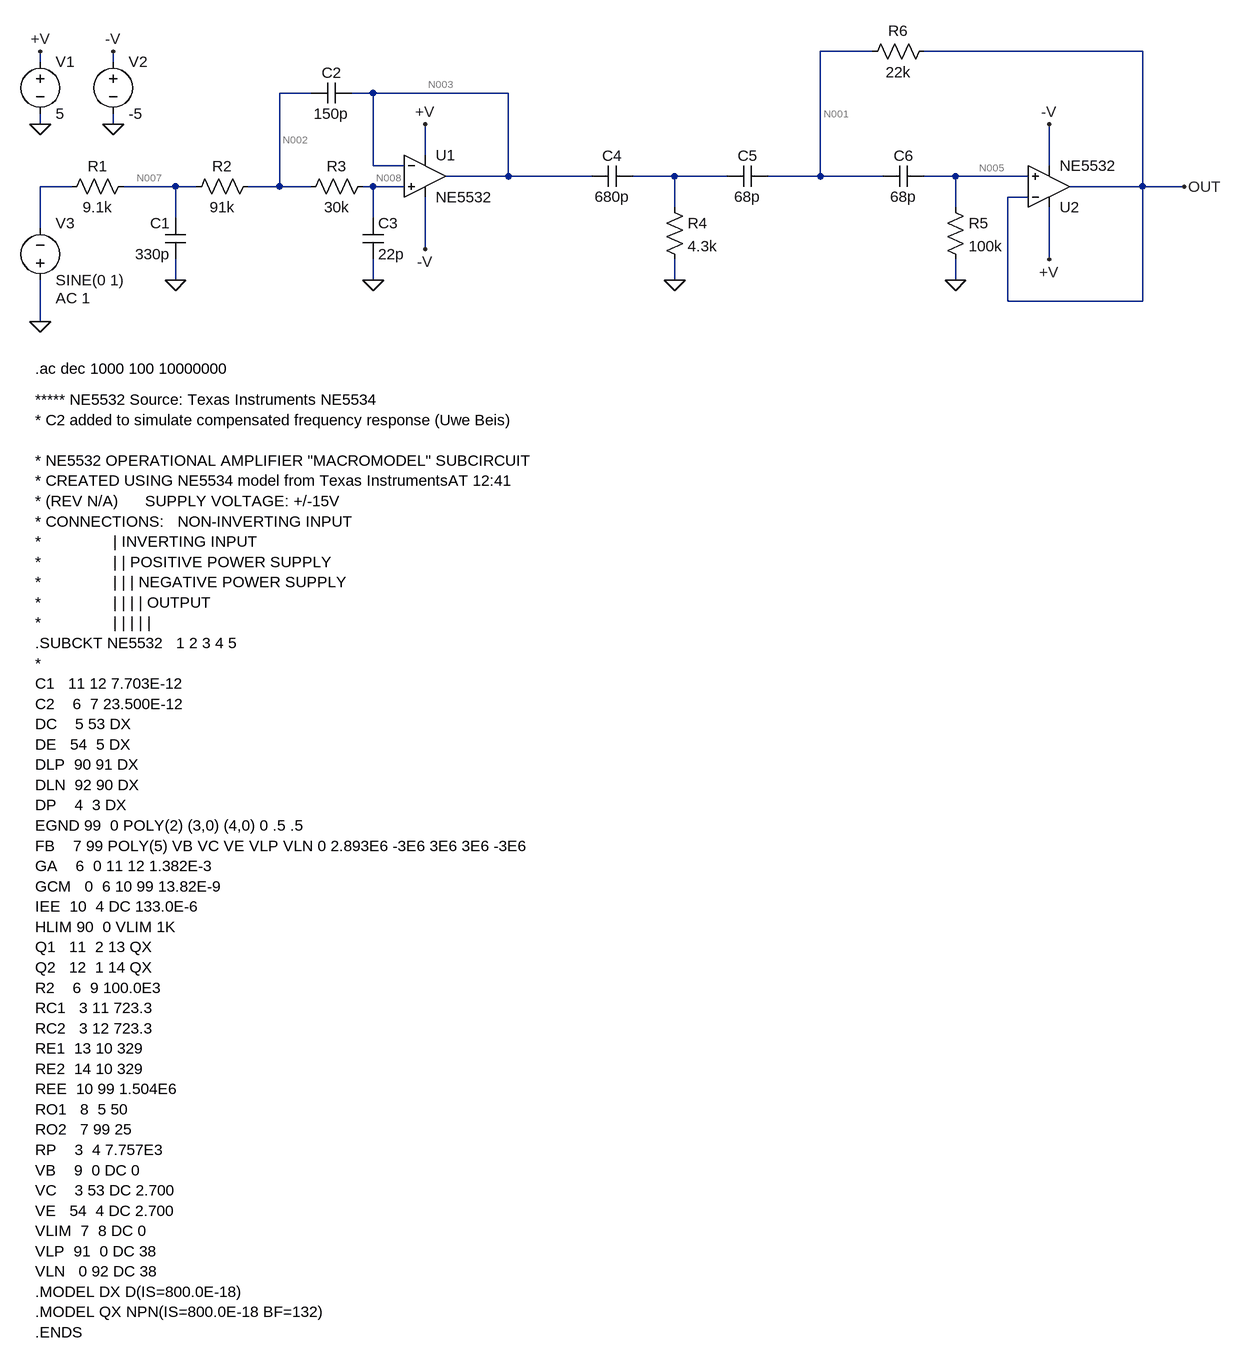
[diagram p0: schematic sallen-key-lp.asc]
sallen-key-lp.asc, the LTspice schematic file:
Version 4
SHEET 1 1432 1664
WIRE 784 -176 704 -176
WIRE 1200 -176 864 -176
WIRE -496 -160 -496 -176
WIRE -384 -160 -384 -176
WIRE -80 -112 -128 -112
WIRE 16 -112 -16 -112
WIRE 224 -112 16 -112
WIRE -496 -64 -496 -80
WIRE -384 -64 -384 -80
WIRE 96 -16 96 -64
WIRE 16 0 16 -112
WIRE 64 0 16 0
WIRE 1056 0 1056 -64
WIRE 224 16 224 -112
WIRE 224 16 128 16
WIRE 352 16 224 16
WIRE 480 16 416 16
WIRE 560 16 480 16
WIRE 704 16 704 -176
WIRE 704 16 624 16
WIRE 800 16 704 16
WIRE 912 16 864 16
WIRE 1024 16 912 16
WIRE -448 32 -496 32
WIRE -288 32 -368 32
WIRE -256 32 -288 32
WIRE -128 32 -128 -112
WIRE -128 32 -176 32
WIRE -80 32 -128 32
WIRE 16 32 0 32
WIRE 64 32 16 32
WIRE 1200 32 1200 -176
WIRE 1200 32 1088 32
WIRE 1264 32 1200 32
WIRE 1024 48 992 48
WIRE 480 64 480 16
WIRE 912 64 912 16
WIRE -288 80 -288 32
WIRE 16 80 16 32
WIRE -496 96 -496 32
WIRE 96 128 96 48
WIRE 1056 144 1056 64
WIRE -288 176 -288 144
WIRE 16 176 16 144
WIRE 480 176 480 144
WIRE 912 176 912 144
WIRE 992 208 992 48
WIRE 1200 208 1200 32
WIRE 1200 208 992 208
WIRE -496 240 -496 176
FLAG -496 -64 0
FLAG -496 -176 +V
FLAG 96 -64 +V
FLAG -384 -64 0
FLAG -384 -176 -V
FLAG 96 128 -V
FLAG -496 240 0
FLAG 1264 32 OUT
FLAG 16 176 0
FLAG -288 176 0
FLAG 480 176 0
FLAG 912 176 0
FLAG 1056 144 +V
FLAG 1056 -64 -V
SYMBOL voltage -496 -176 R0
SYMATTR InstName V1
SYMATTR Value 5
SYMBOL voltage -496 192 M180
WINDOW 0 24 104 Left 2
WINDOW 3 24 16 Left 2
WINDOW 123 24 -12 Left 2
WINDOW 39 0 0 Left 0
SYMATTR InstName V3
SYMATTR Value SINE(0 1)
SYMATTR Value2 AC 1
SYMBOL voltage -384 -176 R0
SYMATTR InstName V2
SYMATTR Value -5
SYMBOL res -352 16 R90
WINDOW 0 0 56 VBottom 2
WINDOW 3 32 56 VTop 2
SYMATTR InstName R1
SYMATTR Value 9.1k
SYMBOL res -160 16 R90
WINDOW 0 0 56 VBottom 2
WINDOW 3 32 56 VTop 2
SYMATTR InstName R2
SYMATTR Value 91k
SYMBOL cap -272 144 R180
WINDOW 0 24 56 Left 2
WINDOW 3 24 8 Left 2
SYMATTR InstName C1
SYMATTR Value 330p
SYMBOL cap -16 -128 R90
WINDOW 0 0 32 VBottom 2
WINDOW 3 32 32 VTop 2
SYMATTR InstName C2
SYMATTR Value 150p
SYMBOL OpAmps\\opamp2 96 -48 R0
SYMATTR InstName U1
SYMATTR Value NE5532
SYMBOL res 16 16 R90
WINDOW 0 0 56 VBottom 2
WINDOW 3 32 56 VTop 2
SYMATTR InstName R3
SYMATTR Value 30k
SYMBOL cap 0 80 R0
SYMATTR InstName C3
SYMATTR Value 22p
SYMBOL cap 416 0 R90
WINDOW 0 0 32 VBottom 2
WINDOW 3 32 32 VTop 2
SYMATTR InstName C4
SYMATTR Value 680p
SYMBOL cap 624 0 R90
WINDOW 0 0 32 VBottom 2
WINDOW 3 32 32 VTop 2
SYMATTR InstName C5
SYMATTR Value 68p
SYMBOL cap 864 0 R90
WINDOW 0 0 32 VBottom 2
WINDOW 3 32 32 VTop 2
SYMATTR InstName C6
SYMATTR Value 68p
SYMBOL res 464 48 R0
SYMATTR InstName R4
SYMATTR Value 4.3k
SYMBOL res 896 48 R0
SYMATTR InstName R5
SYMATTR Value 100k
SYMBOL res 880 -192 R90
WINDOW 0 0 56 VBottom 2
WINDOW 3 32 56 VTop 2
SYMATTR InstName R6
SYMATTR Value 22k
SYMBOL OpAmps\\opamp2 1056 96 M180
SYMATTR InstName U2
SYMATTR Value NE5532
TEXT -504 312 Left 2 !.ac dec 1000 100 10000000
TEXT -504 360 Left 2 !***** NE5532 Source: Texas Instruments NE5534\n* C2 added to simulate compensated frequency response (Uwe Beis)\n \n* NE5532 OPERATIONAL AMPLIFIER "MACROMODEL" SUBCIRCUIT\n* CREATED USING NE5534 model from Texas InstrumentsAT 12:41\n* (REV N/A)      SUPPLY VOLTAGE: +/-15V\n* CONNECTIONS:   NON-INVERTING INPUT\n*                | INVERTING INPUT\n*                | | POSITIVE POWER SUPPLY\n*                | | | NEGATIVE POWER SUPPLY\n*                | | | | OUTPUT\n*                | | | | |\n.SUBCKT NE5532   1 2 3 4 5\n*\nC1   11 12 7.703E-12\nC2    6  7 23.500E-12\nDC    5 53 DX\nDE   54  5 DX\nDLP  90 91 DX\nDLN  92 90 DX\nDP    4  3 DX\nEGND 99  0 POLY(2) (3,0) (4,0) 0 .5 .5\nFB    7 99 POLY(5) VB VC VE VLP VLN 0 2.893E6 -3E6 3E6 3E6 -3E6\nGA    6  0 11 12 1.382E-3\nGCM   0  6 10 99 13.82E-9\nIEE  10  4 DC 133.0E-6\nHLIM 90  0 VLIM 1K\nQ1   11  2 13 QX\nQ2   12  1 14 QX\nR2    6  9 100.0E3\nRC1   3 11 723.3\nRC2   3 12 723.3\nRE1  13 10 329\nRE2  14 10 329\nREE  10 99 1.504E6\nRO1   8  5 50\nRO2   7 99 25\nRP    3  4 7.757E3\nVB    9  0 DC 0\nVC    3 53 DC 2.700\nVE   54  4 DC 2.700\nVLIM  7  8 DC 0\nVLP  91  0 DC 38\nVLN   0 92 DC 38\n.MODEL DX D(IS=800.0E-18)\n.MODEL QX NPN(IS=800.0E-18 BF=132)\n.ENDS

The netlist it stands for:
* sallen-key-lp.asc
V1 +V 0 5
V3 0 N006 SINE(0 1) AC 1
V2 -V 0 -5
R1 N007 N006 9.1k
R2 N002 N007 91k
C1 0 N007 330p
C2 N003 N002 150p
XU1 N008 N003 +V -V N003 NE5532  ; pins In+ In- V+ V- OUT
R3 N008 N002 30k
C3 N008 0 22p
C4 N004 N003 680p
C5 N001 N004 68p
C6 N005 N001 68p
R4 N004 0 4.3k
R5 N005 0 100k
R6 OUT N001 22k
XU2 N005 OUT +V -V OUT NE5532  ; pins In+ In- V+ V- OUT
.ac dec 1000 100 10000000
***** NE5532 Source: Texas Instruments NE5534
* C2 added to simulate compensated frequency response (Uwe Beis)
* NE5532 OPERATIONAL AMPLIFIER "MACROMODEL" SUBCIRCUIT
* CREATED USING NE5534 model from Texas InstrumentsAT 12:41
* (REV N/A)      SUPPLY VOLTAGE: +/-15V
* CONNECTIONS:   NON-INVERTING INPUT
*                | INVERTING INPUT
*                | | POSITIVE POWER SUPPLY
*                | | | NEGATIVE POWER SUPPLY
*                | | | | OUTPUT
*                | | | | |
.SUBCKT NE5532   1 2 3 4 5
*
C1   11 12 7.703E-12
C2    6  7 23.500E-12
DC    5 53 DX
DE   54  5 DX
DLP  90 91 DX
DLN  92 90 DX
DP    4  3 DX
EGND 99  0 POLY(2) (3,0) (4,0) 0 .5 .5
FB    7 99 POLY(5) VB VC VE VLP VLN 0 2.893E6 -3E6 3E6 3E6 -3E6
GA    6  0 11 12 1.382E-3
GCM   0  6 10 99 13.82E-9
IEE  10  4 DC 133.0E-6
HLIM 90  0 VLIM 1K
Q1   11  2 13 QX
Q2   12  1 14 QX
R2    6  9 100.0E3
RC1   3 11 723.3
RC2   3 12 723.3
RE1  13 10 329
RE2  14 10 329
REE  10 99 1.504E6
RO1   8  5 50
RO2   7 99 25
RP    3  4 7.757E3
VB    9  0 DC 0
VC    3 53 DC 2.700
VE   54  4 DC 2.700
VLIM  7  8 DC 0
VLP  91  0 DC 38
VLN   0 92 DC 38
.MODEL DX D(IS=800.0E-18)
.MODEL QX NPN(IS=800.0E-18 BF=132)
.ENDS
.backanno
.end

* Results of the author's LTspice run, read from the files saved beside the schematic
* Operating Point, zero values left out:
*   V(+v) = 5 V
*   V(-v) = -5 V
*   V(n007) = -4.533 mV
*   V(n002) = -49.86 mV
*   V(n003) = -64.8 mV
*   V(n008) = -64.8 mV
*   V(n001) = -49.81 mV
*   V(n005) = -49.82 mV
*   V(out) = -49.81 mV
*   I(R1) = -498.1 nA
*   I(R2) = -498.1 nA
*   I(R3) = -498.1 nA
*   I(R5) = -498.2 nA
*   I(V1) = -2.841 mA
*   I(V3) = 498.1 nA
*   I(V2) = 2.844 mA
*   Ix(u1:1) = 498.1 nA
*   Ix(u1:2) = 498.2 nA
*   Ix(u1:3) = 1.421 mA
*   Ix(u1:4) = -1.422 mA
*   Ix(u1:5) = -498.2 nA
*   Ix(u2:1) = 498.2 nA
*   Ix(u2:2) = 498.2 nA
*   Ix(u2:3) = 1.421 mA
*   Ix(u2:4) = -1.422 mA
*   Ix(u2:5) = -498.2 nA
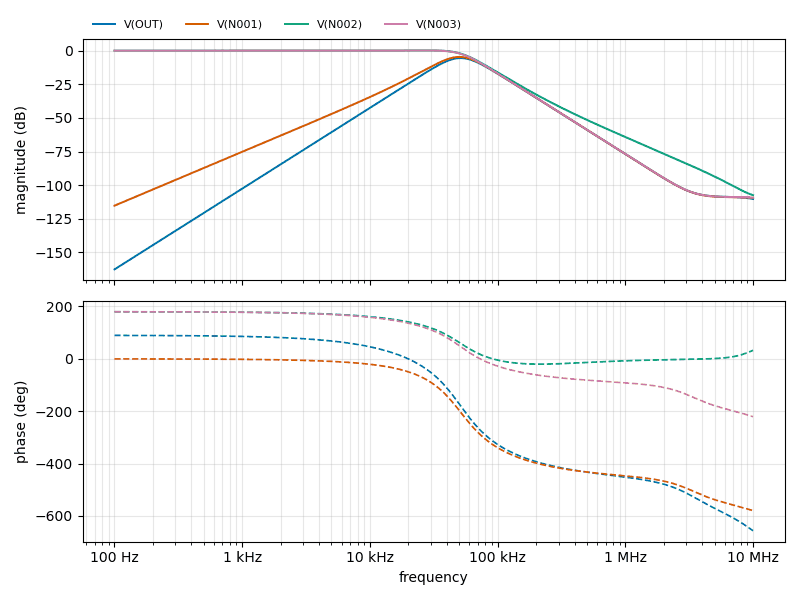
[diagram p1: AC Analysis of sallen-key-lp.asc, plotted from the saved traces]
* AC Analysis, 1 run:
*   V(OUT): -162.65 dB at 100 Hz, -110.30 dB at 10 MHz, peak -5.51 dB at 51.29 kHz, 3 dB below the peak at 38.43 kHz and 68.57 kHz
*   V(N001): -115.26 dB at 100 Hz, -109.42 dB at 10 MHz, peak -4.66 dB at 50.35 kHz, 3 dB below the peak at 37.25 kHz and 67.3 kHz
*   V(N002): -0.00 dB at 100 Hz, -107.44 dB at 10 MHz, peak 0.20 dB at 27.42 kHz, 3 dB below the peak at 53.83 kHz
*   V(N003): -0.00 dB at 100 Hz, -109.32 dB at 10 MHz, peak 0.14 dB at 26 kHz, 3 dB below the peak at 53.24 kHz